# Altium project PCB_EM23_BTRC.PrjPcb
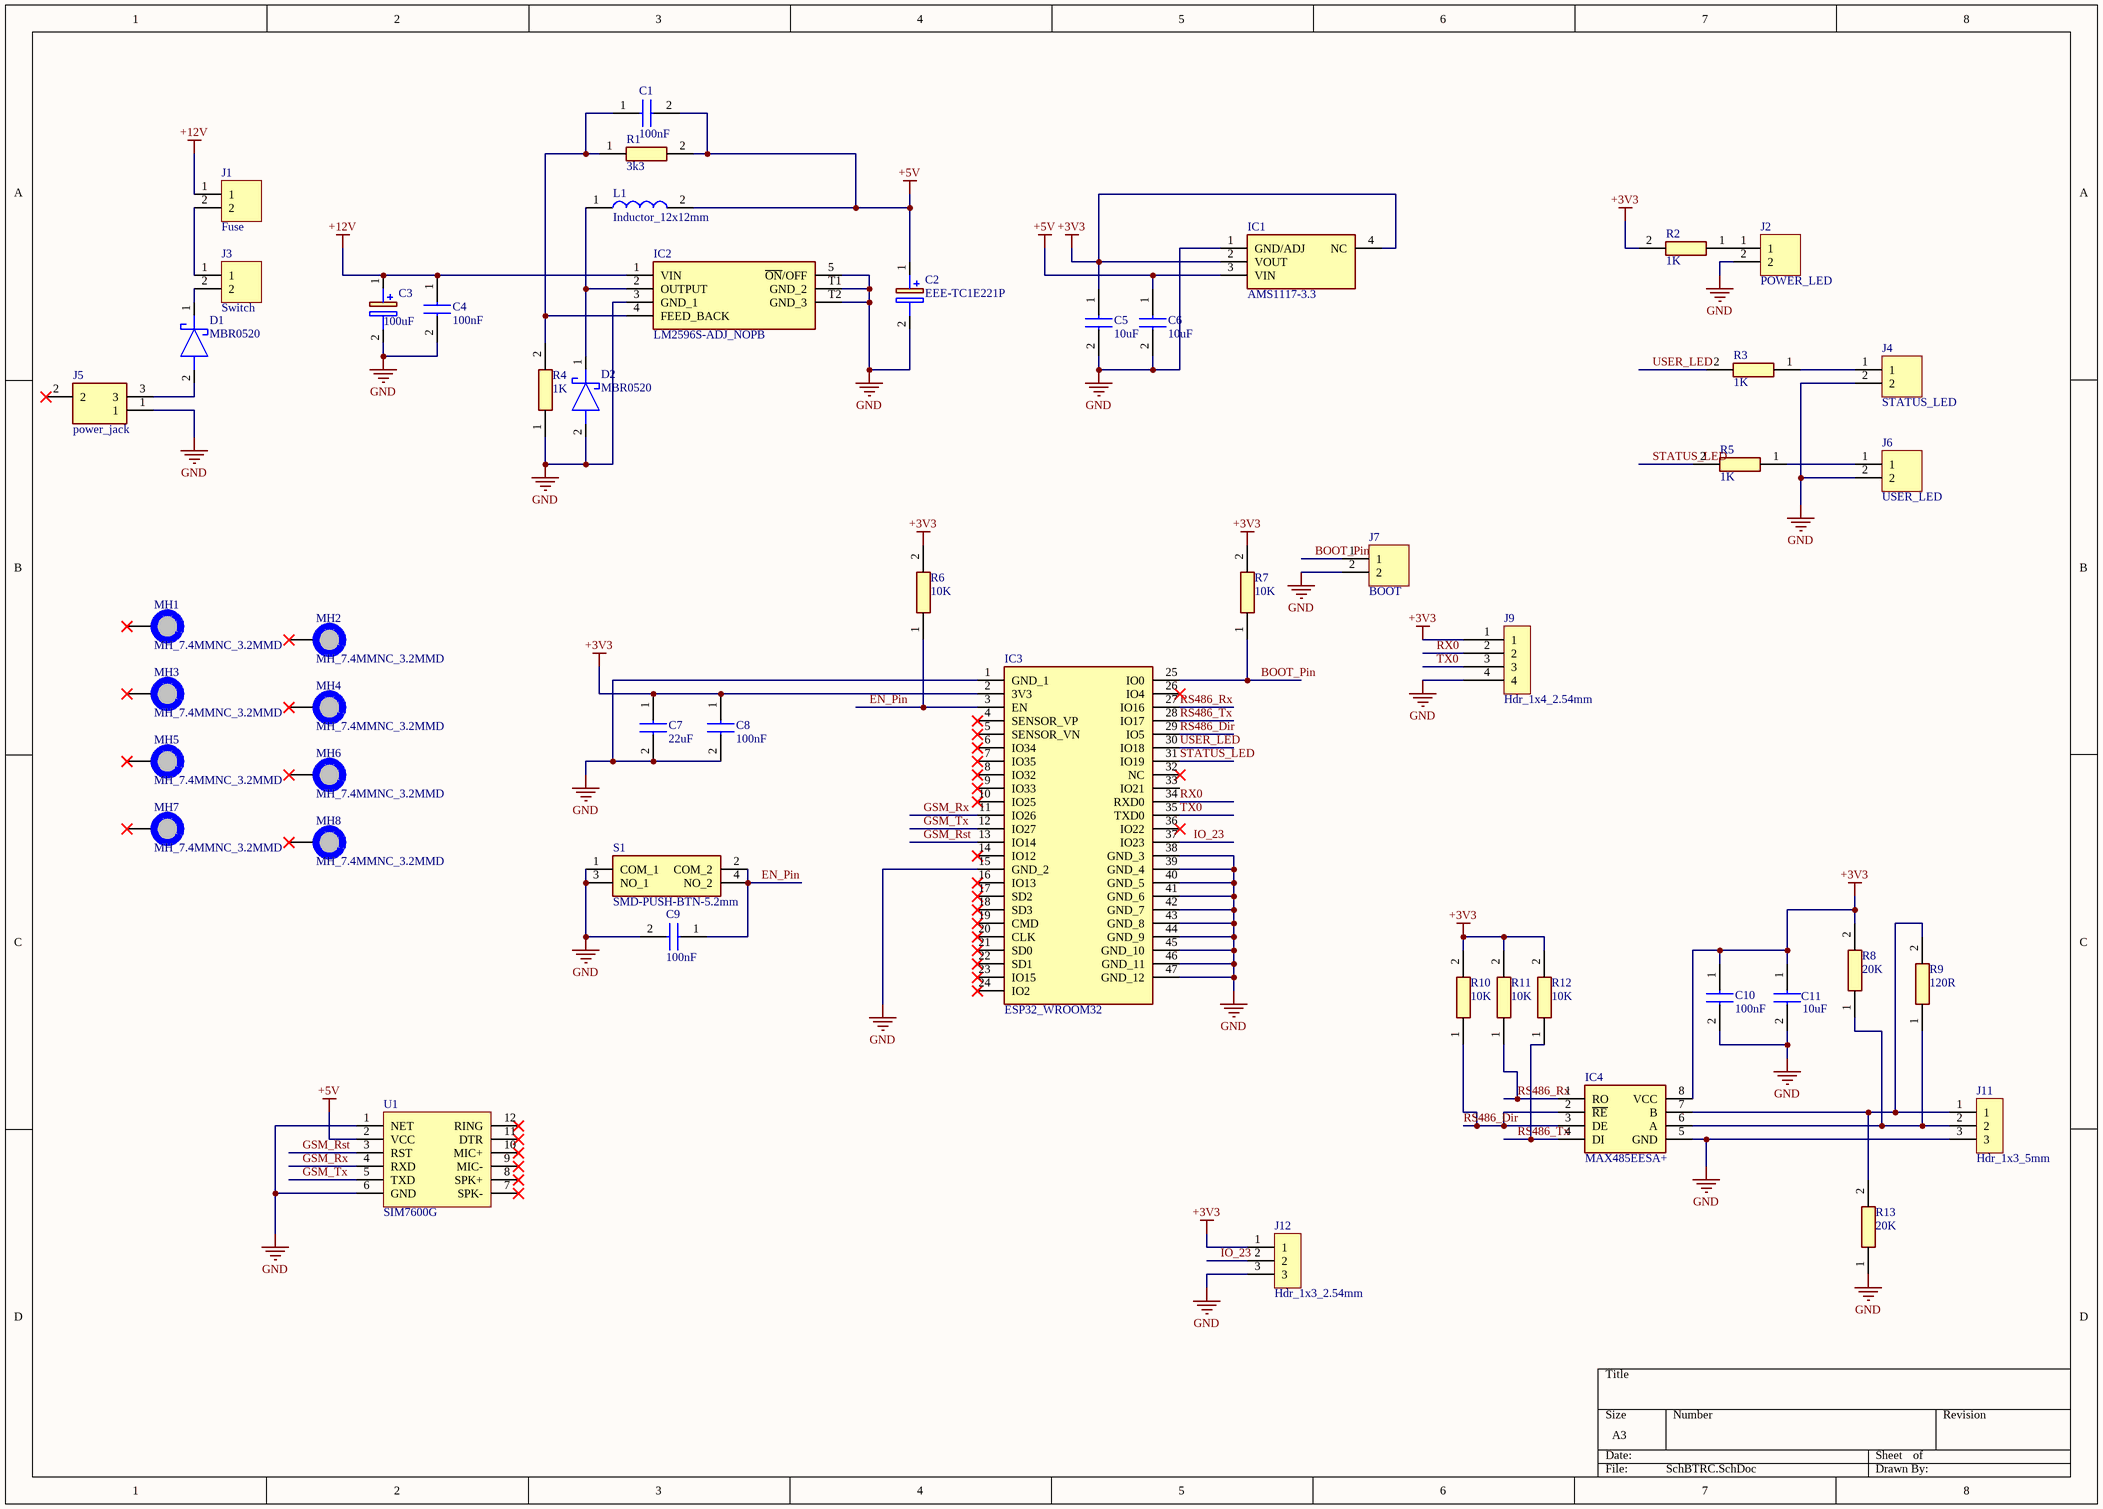
[diagram p0: SchBTRC.SchDoc]
1 sheet, 51 parts. Net scope: global (net labels, ports and power ports of the same name join across sheets).
Board file: PCB_BTRC.PcbDoc

## Sheet SchBTRC.SchDoc
size A3; SheetNumber: 1; SheetTotal: 1

### Parts
C1  100nF  [CAPC3216X100N]
C2  EEE-TC1E221P  [EEE0JA152UAP]
C3  100uF  [EEE0JA331XP]
C4  100nF  [CAPC3216X100N]
C5  10uF  [CAPC3216X100N]
C6  10uF  [CAPC3216X100N]
C7  22uF  [CAPC3216X100N]
C8  100nF  [CAPC3216X100N]
C9  100nF  [CAPC3216X100N]
C10  100nF  [CAPC3216X100N]
C11  10uF  [CAPC3216X100N]
D1  MBR0520  [SOD3716X120N]
D2  MBR0520  [SOD3716X120N]
IC1  AMS1117-3.3  [SOT229P700X180-4N]
IC2  LM2596S-ADJ_NOPB  [LM2596SXADJ]
IC3  ESP32_WROOM32  [ESP32WROOM32]
IC4  MAX485EESA+  [SOIC127P600X175-8N]
J1  Fuse  [HDR_1x2_2.54mm]
J2  POWER_LED  [HDR_1x2_2.54mm]
J3  Switch  [HDR_1x2_2.54mm]
J4  STATUS_LED  [HDR_1x2_2.54mm]
J5  power_jack  [power_jack]
J6  USER_LED  [HDR_1x2_2.54mm]
J7  BOOT  [HDR_1x2_2.54mm]
J9  Hdr_1x4_2.54mm  [Hdr_1x4_2.54mm]
J11  Hdr_1x3_5mm  [Hdr_1x3_5.0mm]
J12  Hdr_1x3_2.54mm  [Hdr_1x3_2.54mm]
L1  Inductor_12x12mm  [Inductor_12x12mm]
MH1  MH_7.4MMNC_3.2MMD  [MH_7.4MMNC_3.2MMD_NON_COPPER_NPTH]
MH2  MH_7.4MMNC_3.2MMD  [MH_7.4MMNC_3.2MMD_NON_COPPER_NPTH]
MH3  MH_7.4MMNC_3.2MMD  [MH_7.4MMNC_3.2MMD_NON_COPPER_NPTH]
MH4  MH_7.4MMNC_3.2MMD  [MH_7.4MMNC_3.2MMD_NON_COPPER_NPTH]
MH5  MH_7.4MMNC_3.2MMD  [MH_7.4MMNC_3.2MMD_NON_COPPER_NPTH]
MH6  MH_7.4MMNC_3.2MMD  [MH_7.4MMNC_3.2MMD_NON_COPPER_NPTH]
MH7  MH_7.4MMNC_3.2MMD  [MH_7.4MMNC_3.2MMD_NON_COPPER_NPTH]
MH8  MH_7.4MMNC_3.2MMD  [MH_7.4MMNC_3.2MMD_NON_COPPER_NPTH]
R1  3k3  [RESC3216X75N]
R2  1K  [RESC3216X75N]
R3  1K  [RESC3216X75N]
R4  1K  [RESC3216X75N]
R5  1K  [RESC3216X75N]
R6  10K  [RESC3216X75N]
R7  10K  [RESC3216X75N]
R8  20K  [RESC3216X75N]
R9  120R  [RESC3216X75N]
R10  10K  [RESC3216X75N]
R11  10K  [RESC3216X75N]
R12  10K  [RESC3216X75N]
R13  20K  [RESC3216X75N]
S1  SMD-PUSH-BTN-5.2mm  [SMS_PUSH_BTN_5.2x5.2mm]
U1  SIM7600G  [SIM7600G_Module]

### Nets
+3V3: C5.1 C7.1 C8.1 C10.1 C11.1 IC1.2(VOUT) IC1.4(NC) IC3.2(3V3) IC4.8(VCC) J9.1 J12.1 R2.2 R6.2 R7.2 R8.2 R10.2 R11.2 R12.2
+5V: C1.2 C2.1(+) C6.1 IC1.3(VIN) L1.2 R1.2 U1.2(VCC)
+12V: C3.1(+) C4.1 IC2.1(VIN) J1.1
GND: C2.2(-) C3.2(-) C4.2 C5.2 C6.2 C7.2 C8.2 C9.2 C10.2 C11.2 D2.2(A) IC1.1(GND/ADJ) IC2.3(GND_1) IC2.5(~{ON}/OFF) IC2.T1(GND_2) IC2.T2(GND_3) IC3.1(GND_1) IC3.15(GND_2) IC3.38(GND_3) IC3.39(GND_4) IC3.40(GND_5) IC3.41(GND_6) IC3.42(GND_7) IC3.43(GND_8) IC3.44(GND_9) IC3.45(GND_10) IC3.46(GND_11) IC3.47(GND_12) IC4.5(GND) J2.2 J4.2 J5.1 J6.2 J7.2 J9.4 J11.3 J12.3 R4.1 R13.1 S1.1(COM_1) S1.3(NO_1) U1.1(NET) U1.6(GND)
BOOT_Pin: IC3.25(IO0) J7.1 R7.1
EN_Pin: C9.1 IC3.3(EN) R6.1 S1.2(COM_2) S1.4(NO_2)
GSM_Rst: IC3.13(IO14) U1.3(RST)
GSM_Rx: IC3.11(IO26) U1.4(RXD)
GSM_Tx: IC3.12(IO27) U1.5(TXD)
IO_23: IC3.37(IO23) J12.2
RS486_Dir: IC3.29(IO5) IC4.2(~{RE}) IC4.3(DE) R10.1
RS486_Rx: IC3.27(IO16) IC4.1(RO) R11.1
RS486_Tx: IC3.28(IO17) IC4.4(DI) R12.1
RX0: IC3.34(RXD0) J9.2
STATUS_LED: IC3.31(IO19) R5.2
TX0: IC3.35(TXD0) J9.3
USER_LED: IC3.30(IO18) R3.2
NetC1_1: C1.1 IC2.4(FEED_BACK) R1.1 R4.2
NetD1_1: D1.1(K) J3.2
NetD1_2: D1.2(A) J5.3
NetD2_1: D2.1(K) IC2.2(OUTPUT) L1.1
NetIC4_6: IC4.6(A) J11.2 R8.1 R9.1
NetIC4_7: IC4.7(B) J11.1 R9.2 R13.2
NetJ1_2: J1.2 J3.1
NetJ2_1: J2.1 R2.1
NetJ4_1: J4.1 R3.1
NetJ6_1: J6.1 R5.1

Not connected (* = marked no-connect by the designer): IC3 4(SENSOR_VP)* 5(SENSOR_VN)* 6(IO34)* 7(IO35)* 8(IO32)* 9(IO33)* 10(IO25)* 14(IO12)* 16(IO13)* 17(SD2)* 18(SD3)* 19(CMD)* 20(CLK)* 21(SD0)* 22(SD1)* 23(IO15)* 24(IO2)* 26(IO4)* 32(NC)* 33(IO21) 36(IO22)*; J5 2*; MH1 1*; MH2 1*; MH3 1*; MH4 1*; MH5 1*; MH6 1*; MH7 1*; MH8 1*; U1 7(SPK-)* 8(SPK+)* 9(MIC-)* 10(MIC+)* 11(DTR)* 12(RING)*

### Library data of the parts
C1 C4-C11 = C3216X5R1C106K085AC: Capacitor; Manufacturer_Name: TDK; Datasheet Link: https://product.tdk.com/info/en/catalog/datasheets/mlcc_commercial_midvoltage_en.pdf; Height: 1mm; Manufacturer_Part_Number: C3216X5R1C106K085AC; Mouser Part Number: 810-C3216X5R1C106K0C; Mouser Price/Stock: https://www.mouser.com/Search/Refine.aspx?Keyword=810-C3216X5R1C106K0C
C2 = EEE-TC1E221P: Capacitor Polarised; Manufacturer_Name: Panasonic; Datasheet Link: http://industrial.panasonic.com/cdbs/www-data/pdf/RDE0000/ABA0000C678.pdf; Height: 12mm; Manufacturer_Part_Number: EEE-TC1E221P; Mouser Part Number: 667-EEE-TC1E221P; Mouser Price/Stock: https://www.mouser.co.uk/ProductDetail/Panasonic/EEE-TC1E221P?qs=367PjNmvCmnTZpcwe6iq6Q%3D%3D; Arrow Part Number: EEE-TC1E221P; Arrow Price/Stock: https://www.arrow.com/en/products/eee-tc1e221p/panasonic?region=nac
C3 = EEE-TC1C101XP: Capacitor Polarised; Manufacturer_Name: Panasonic; Datasheet Link: http://industrial.panasonic.com/cdbs/www-data/pdf/RDE0000/ABA0000C678.pdf; Height: 7.8mm; Manufacturer_Part_Number: EEE-TC1C101XP; Mouser Part Number: 667-EEE-TC1C101XP; Mouser Price/Stock: https://www.mouser.co.uk/ProductDetail/Panasonic/EEE-TC1C101XP?qs=367PjNmvCmntb8uQ4S3WYg%3D%3D; Arrow Part Number: EEE-TC1C101XP; Arrow Price/Stock: https://www.arrow.com/en/products/eee-tc1c101xp/panasonic
D1 D2 = MBR0520: Schottky Diode; Manufacturer_Name: Shikues; Datasheet Link: https://datasheet.lcsc.com/szlcsc/2001131004_Shikues-MBR0520_C475717.pdf; Height: 1.2mm; Manufacturer_Part_Number: MBR0520
IC1 = AMS1117-3.3: Integrated Circuit; Manufacturer_Name: Advanced; Datasheet Link: https://datasheet.datasheetarchive.com/originals/distributors/Datasheets-28/DSA-550594.pdf; Height: 1.8mm; Manufacturer_Part_Number: AMS1117-3.3
IC2 = LM2596S-ADJ_NOPB: Integrated Circuit; Manufacturer_Name: Texas Instruments; Manufacturer_Part_Number: LM2596S-ADJ/NOPB; Datasheet Link: https://www.ti.com/lit/ds/symlink/lm2596.pdf?HQS=ti-null-null-sf-df-pf-sep-wwe&ts=1592978195629; Height: 4.57mm; Mouser Part Number: 926-LM2596S-ADJ/NOPB; Mouser Price/Stock: https://www.mouser.co.uk/ProductDetail/Texas-Instruments/LM2596S-ADJ-NOPB?qs=X1J7HmVL2ZHoMN0DLDcNog%3D%3D; Arrow Part Number: LM2596S-ADJ/NOPB; Arrow Price/Stock: https://www.arrow.com/en/products/lm2596s-adjnopb/texas-instruments?region=nac
IC3 = ESP32_WROOM32: Integrated Circuit; Manufacturer_Name: Espressif Systems; Manufacturer_Part_Number: ESP32 WROOM32; Datasheet Link: https://www.espressif.com/sites/default/files/documentation/esp32-wroom-32_datasheet_en.pdf; Height: 3.2mm
IC4 = MAX485EESA+: Integrated Circuit; Manufacturer_Name: Analog Devices; Datasheet Link: http://datasheets.maximintegrated.com/en/ds/MAX1487E-MAX491E.pdf; Height: 1.75mm; Manufacturer_Part_Number: MAX485EESA+; Mouser Part Number: 700-MAX485EESA; Mouser Price/Stock: https://www.mouser.co.uk/ProductDetail/Analog-Devices-Maxim-Integrated/MAX485EESA%2b?qs=1THa7WoU59HlqXlxuUW1Fg%3D%3D; Arrow Part Number: MAX485EESA+; Arrow Price/Stock: https://www.arrow.com/en/products/max485eesa/maxim-integrated?region=nac
J1-J4 J6 J7 = Hdr_1x2_2.54mm
J5 = power_jack: Connector; Manufacturer_Name: LUMBERG; Manufacturer_Part_Number: 1613 20; Datasheet Link: http://www.farnell.com/datasheets/2349122.pdf; Height: 7mm
L1 = Inductor_12x12mm: Inductor; Manufacturer_Name: Wurth Elektronik; Manufacturer_Part_Number: 744774147; Mouser Part Number: 710-744774147; Mouser Price/Stock: https://www.mouser.co.uk/ProductDetail/Wurth-Elektronik/744774147?qs=rS3zZhy2AQMMwor0dxnQcQ%3D%3D
R1-R13 = CR1206-F_-2R00ELF: Resistor; Manufacturer_Name: Bourns; Manufacturer_Part_Number: CR1206-F/-2R00ELF; Height: 0.75mm; Mouser Part Number: 652-CR1206-F/2R00ELF; Mouser Price/Stock: https://www.mouser.co.uk/ProductDetail/Bourns/CR1206-F-2R00ELF?qs=W%2FMpXkg%252BdQ47Z%2FeZv1nDSg%3D%3D
S1 = SMD-PUSH-BTN-5.2mm: Switch; Manufacturer_Name: SparkFun; Manufacturer_Part_Number: COM-08720; Datasheet Link: https://www.sparkfun.com/datasheets/Components/Buttons/SMD-Button.pdf; Height: 1.6mm; Mouser Part Number: 474-COM-08720; Mouser Price/Stock: https://www.mouser.co.uk/ProductDetail/SparkFun/COM-08720?qs=WyAARYrbSnaaMDwitZjU3A%3D%3D; Arrow Part Number: COM-08720; Arrow Price/Stock: https://www.arrow.com/en/products/com-08720/sparkfun-electronics?region=nac
U1 = SIM7600G_Module